# EAGLE design dustmap (EAGLE 9.4.1)
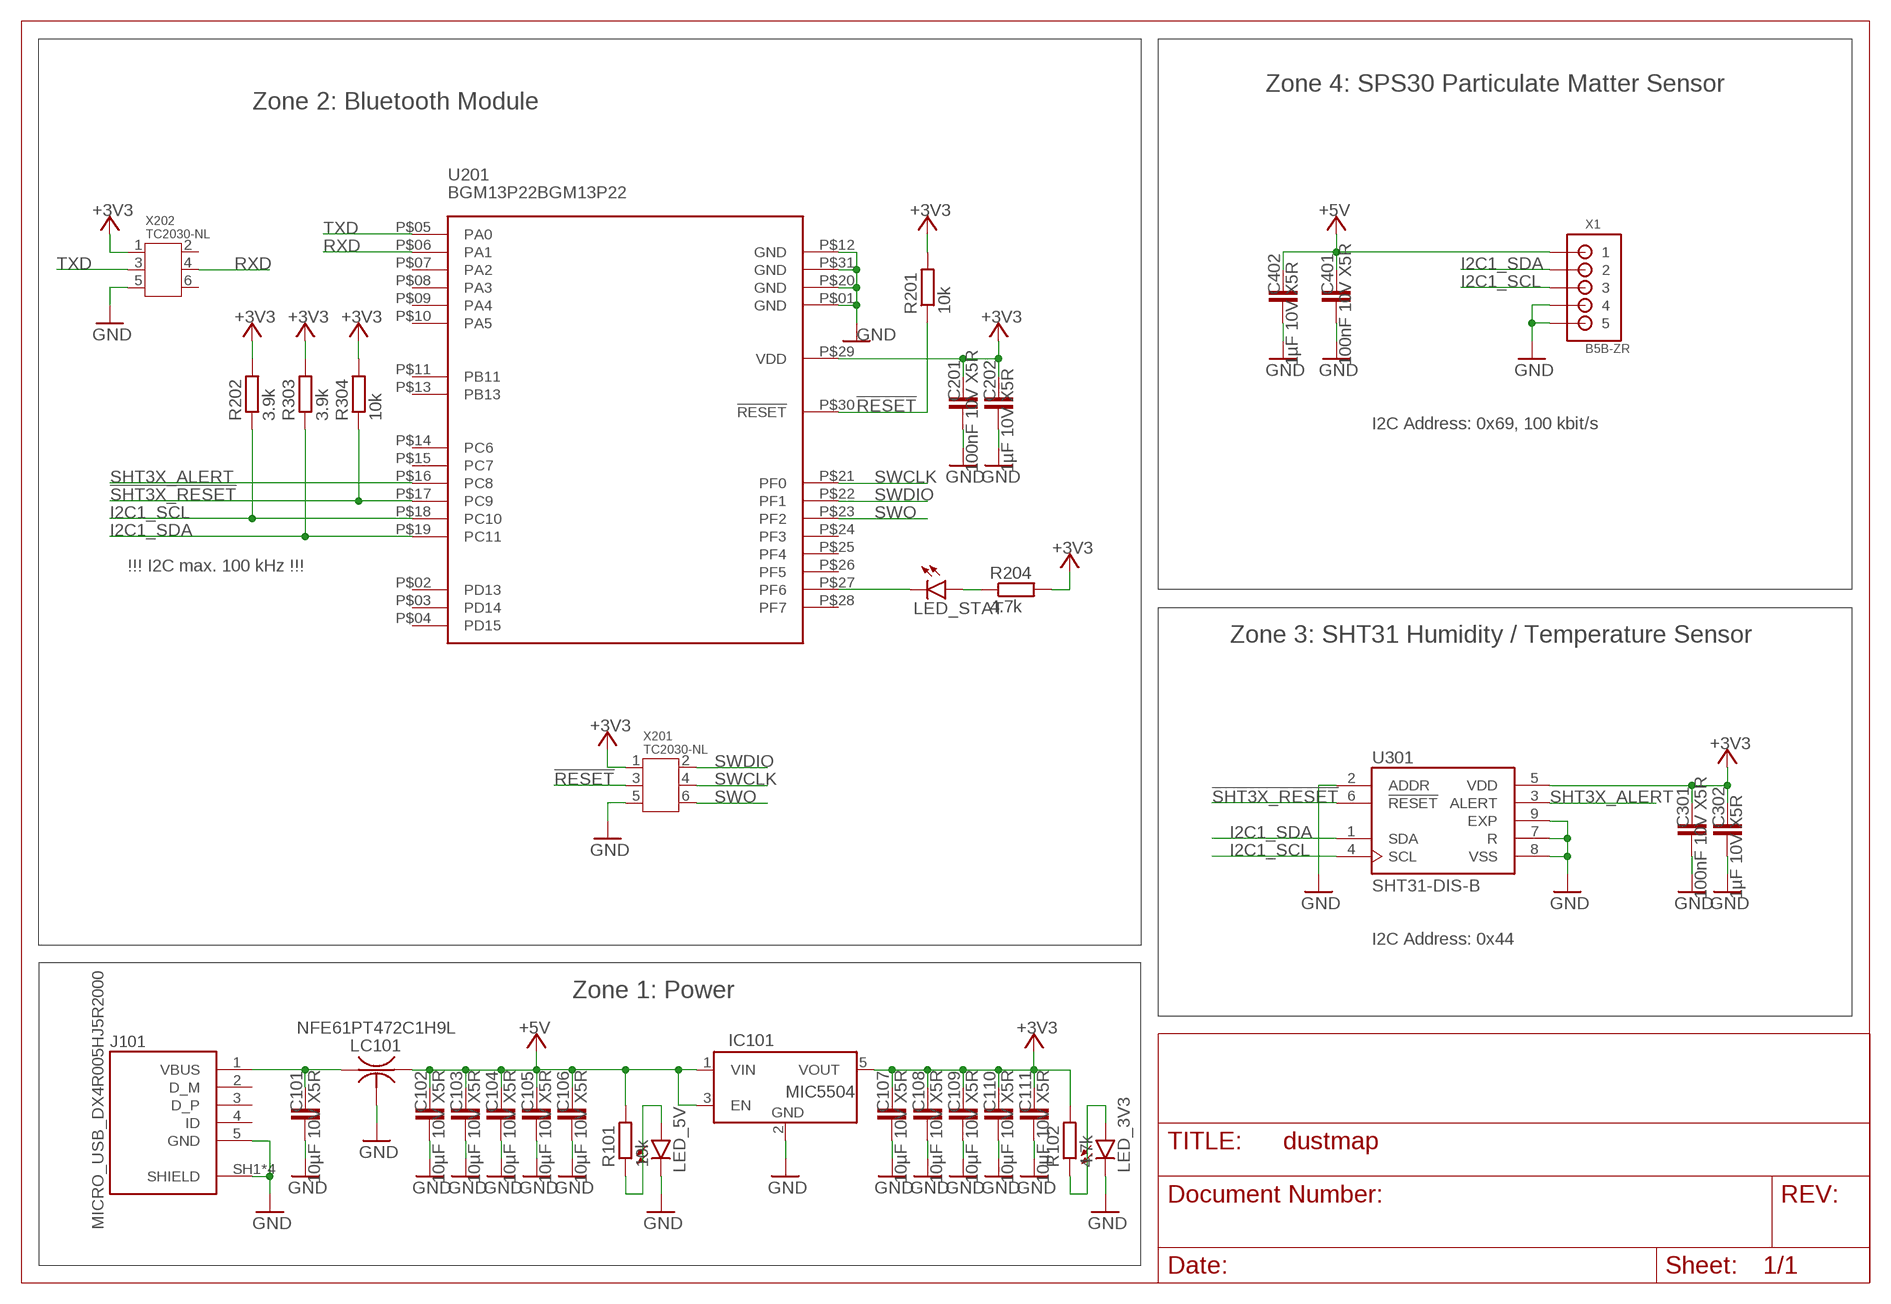
[diagram p0: schematic, sheet 1]

## Parts
C101  10µF 10V X5R  C-EUC0603  [C0603]
C102  10µF 10V X5R  C-EUC0603  [C0603]
C103  10µF 10V X5R  C-EUC0603  [C0603]
C104  10µF 10V X5R  C-EUC0603  [C0603]
C105  10µF 10V X5R  C-EUC0603  [C0603]
C106  10µF 10V X5R  C-EUC0603  [C0603]
C107  10µF 10V X5R  C-EUC0603  [C0603]
C108  10µF 10V X5R  C-EUC0603  [C0603]
C109  10µF 10V X5R  C-EUC0603  [C0603]
C110  10µF 10V X5R  C-EUC0603  [C0603]
C111  10µF 10V X5R  C-EUC0603  [C0603]
C201  100nF 10V X5R  C-EUC0603  [C0603]
C202  1µF 10V X5R  C-EUC0603  [C0603]
C301  100nF 10V X5R  C-EUC0603  [C0603]
C302  1µF 10V X5R  C-EUC0603  [C0603]
C401  100nF 10V X5R  C-EUC0603  [C0603]
C402  1µF 10V X5R  C-EUC0603  [C0603]
IC101  MIC5504  [SOT23-5]
J101  MICRO_USB_DX4R005HJ5R2000  [JAE_DX4R005HJ5R2000]
LC101  NFE61PT472C1H9L  [CAP_NFE61P_6P8X1P6]
LED_3V3  LEDCHIP-LED0603  [CHIP-LED0603]
LED_5V  LEDCHIP-LED0603  [CHIP-LED0603]
LED_STAT  LEDCHIP-LED0603  [CHIP-LED0603]
R101  10k  R-EU_R0603  [R0603]
R102  4.7k  R-EU_R0603  [R0603]
R201  10k  R-EU_R0603  [R0603]
R202  3.9k  R-EU_R0603  [R0603]
R204  4.7k  R-EU_R0603  [R0603]
R303  3.9k  R-EU_R0603  [R0603]
R304  10k  R-EU_R0603  [R0603]
U201  BGM13P22BGM13P22  [BGM13P22]
U301  SHT31-DIS-B  [SON50P250X250X100-9N]
X1  B5B-ZR  [B5B-ZR]
X201  TC2030-NL  [TC2030-NL]
X202  TC2030-NL  [TC2030-NL]

## Nets
!RESET: R201.1 U201.P$30(!RESET) X201.3
!SHT3X_RESET: R304.1 U201.P$17(PC9) U301.6(!RESET)
+3V3: C107.1 C108.1 C109.1 C110.1 C111.1 C201.1 C202.1 C301.1 C302.1 IC101.5(VOUT) R102.2 R201.2 R202.2 R204.2 R303.2 R304.2 U201.P$29(VDD) U301.5(VDD) X201.1 X202.1
+5V: C102.1 C103.1 C104.1 C105.1 C106.1 C401.1 C402.1 IC101.1(VIN) IC101.3(EN) LC101.3 R101.2 X1.1
GND: C101.2 C102.2 C103.2 C104.2 C105.2 C106.2 C107.2 C108.2 C109.2 C110.2 C111.2 C201.2 C202.2 C301.2 C302.2 C401.2 C402.2 IC101.2(GND) J101.5(GND) J101.SH1(SHIELD) J101.SH2(SHIELD) J101.SH3(SHIELD) J101.SH4(SHIELD) LC101.2 LED_3V3.C LED_5V.C U201.P$01(GND) U201.P$12(GND) U201.P$20(GND) U201.P$31(GND) U301.2(ADDR) U301.7(R) U301.8(VSS) U301.9(EXP) X1.4 X1.5 X201.5 X202.5
I2C1_SCL: R202.1 U201.P$18(PC10) U301.4(SCL) X1.3
I2C1_SDA: R303.1 U201.P$19(PC11) U301.1(SDA) X1.2
N$1: LED_5V.A R101.1
N$2: C101.1 J101.1(VBUS) LC101.1
N$3: LED_STAT.C U201.P$27(PF6)
N$4: LED_STAT.A R204.1
N$5: LED_3V3.A R102.1
RXD: U201.P$06(PA1) X202.4
SHT3X_ALERT: U201.P$16(PC8) U301.3(ALERT)
SWCLK: U201.P$21(PF0) X201.4
SWDIO: U201.P$22(PF1) X201.2
SWO: U201.P$23(PF2) X201.6
TXD: U201.P$05(PA0) X202.3
Unconnected: J101.2(D_M) J101.3(D_P) J101.4(ID) U201.P$02(PD13) U201.P$03(PD14) U201.P$04(PD15) U201.P$07(PA2) U201.P$08(PA3) U201.P$09(PA4) U201.P$10(PA5) U201.P$11(PB11) U201.P$13(PB13) U201.P$14(PC6) U201.P$15(PC7) U201.P$24(PF3) U201.P$25(PF4) U201.P$26(PF5) U201.P$28(PF7) X202.2 X202.6

## Notes on the sheet
- Zone 4: SPS30 Particulate Matter Sensor
- Zone 2: Bluetooth Module
- I2C Address: 0x69, 100 kbit/s
- !!! I2C max. 100 kHz !!!
- Zone 3: SHT31 Humidity / Temperature Sensor
- I2C Address: 0x44
- Zone 1: Power

## Library data of the parts
C101-C111 C201 C202 C301 C302 C401 C402 = rcl:C-EU: CAPACITOR, European symbol; SPICEPREFIX: C
IC101 = q:MIC5504
J101 = q:MICRO_USB_DX4R005HJ5R2000: RCPT MICRO USB 2.0 B SMT H/D; DESCRIPTION: DX4 series, receptacle, on-board, right-angle standard mount, surface mount; DIGI-KEY_PART_NUMBER: 670-2674-1-ND; DIGI-KEY_PURCHASE_URL: https://www.digikey.at/product-detail/en/jae-electronics/DX4R005HJ5R2000/670-2674-1-ND/3903234?utm_source=snapeda&utm_medium=aggregator&utm_campaign=symbol; MF: JAE Electronics; MP: DX4R005HJ5R2000; PACKAGE: None
LC101 = q:NFE61PT472C1H9L
LED_3V3 LED_5V LED_STAT = led:LED: LED OSRAM: - CHIPLED LG R971, LG N971, LY N971, LG Q971, LY Q971, LO R971, LY R971 LH N974, LH R974 LS Q976, LO Q976, LY Q976 LO Q996 - Hyper CHIPLED LW Q18S LB Q993, LB Q99A, LB R99A - SideLED LS A670, LO A670, LY A670, LG A670, LP A670 LB A673, LV A673, LT A673, LW A673 LH A674 LY A675 LS A676, LA A676, LO A676, LY A676, LW A676 LS A679, LY A679, LG A679 - Hyper Micro SIDELED® LS Y876, LA Y876, LO Y876, LY Y876 LT Y87S - SmartLED LW L88C, LW L88S LB L89C, LB L89S, LG L890 LS L89K, LO L89K, LY L89K LS L896, LA L896, LO L896, LY L896 - TOPLED LS T670, LO T670, LY T670, LG T670, LP T670 LSG T670, LSP T670, LSY T670, LOP T670, LYG T670 LG T671, LOG T671, LSG T671 LB T673, LV T673, LT T673, LW T673 LH T674 LS T676, LA T676, LO T676, LY T676, LB T676, LH T676, LSB T676, LW T676 LB T67C, LV T67C, LT T67C, LS T67K, LO T67K, LY T67K, LW E67C LS E67B, LA E67B, LO E67B, LY E67B, LB E67C, LV E67C, LT E67C LW T67C LS T679, LY T679, LG T679 LS T770, LO T770, LY T770, LG T770, LP T770 LB T773, LV T773, LT T773, LW T773 LH T774 LS E675, LA E675, LY E675, LS T675 LS T776, LA T776, LO T776, LY T776, LB T776 LHGB T686 LT T68C, LB T68C - Hyper Mini TOPLED® LB M676 - Mini TOPLED Santana® LG M470 LS M47K, LO M47K, LY M47K Source: http://www.osram.convergy.de LUXEON: - LUMILED® LXK2-PW12-R00, LXK2-PW12-S00, LXK2-PW14-U00, LXK2-PW14-V00 LXK2-PM12-R00, LXK2-PM12-S00, LXK2-PM14-U00 LXK2-PE12-Q00, LXK2-PE12-R00, LXK2-PE12-S00, LXK2-PE14-T00, LXK2-PE14-U00 LXK2-PB12-K00, LXK2-PB12-L00, LXK2-PB12-M00, LXK2-PB14-N00, LXK2-PB14-P00, LXK2-PB14-Q00 LXK2-PR12-L00, LXK2-PR12-M00, LXK2-PR14-Q00, LXK2-PR14-R00 LXK2-PD12-Q00, LXK2-PD12-R00, LXK2-PD12-S00 LXK2-PH12-R00, LXK2-PH12-S00 LXK2-PL12-P00, LXK2-PL12-Q00, LXK2-PL12-R00 Source: www.luxeon.com KINGBRIGHT: KA-3528ASYC Source: www.kingbright.com
R101 R102 R201 R202 R204 R303 R304 = rcl:R-EU_: RESISTOR, European symbol; SPICEPREFIX: R
U201 = quadratic:BGM13P22: Silicon Labs BGM13P22 BLE-Module Bluetooth 5 Radio 2.4 GHz GFSK Up to +8 Programmable Output Power 9.9 mA RX Current 9.5 mA Active-mode TX at 0 dBm MCU and Memory Options 40 MHz ARM Cortex®-M4 Low Active Mode Current: 87 µA/MHz 512 kB Flash 64 kB RAM BGM13P22 auf der silicon labs <https://www.silabs.com/products/wireless/bluetooth/bluetooth-low-energy-modules/bgm13p-bluetooth-module>
U301 = q:SHT31-DIS-B: SHT31 Series 5.5 V 800 µA Surface Mount Humidity and Temperature Sensor; AVAILABILITY: Unavailable; DESCRIPTION: SHT31 Series 5.5 V 800 µA Surface Mount Humidity and Temperature Sensor; MF: Sensirion AG; MP: SHT31-DIS-B; PACKAGE: TDFN-8 Sensirion; PRICE: None
X1 = q:B5B-ZR: JST-ZH Connector 5 pol, 1.5mm pitch Package: B5B-ZR Source: http://www.jst-mfg.com/product/pdf/eng/eZH.pdf
X201 X202 = X:TC2030: Tag-Connect In Circuit Programming & Debug Cable with IDC connector, 6 Pin Sources: http://www.tag-connect.com/TC2030-IDC http://www.tag-connect.com/TC2030-MCP http://www.tag-connect.com/TC2030-IDC-NL http://www.tag-connect.com/TC2030-MCP-NL

## Board
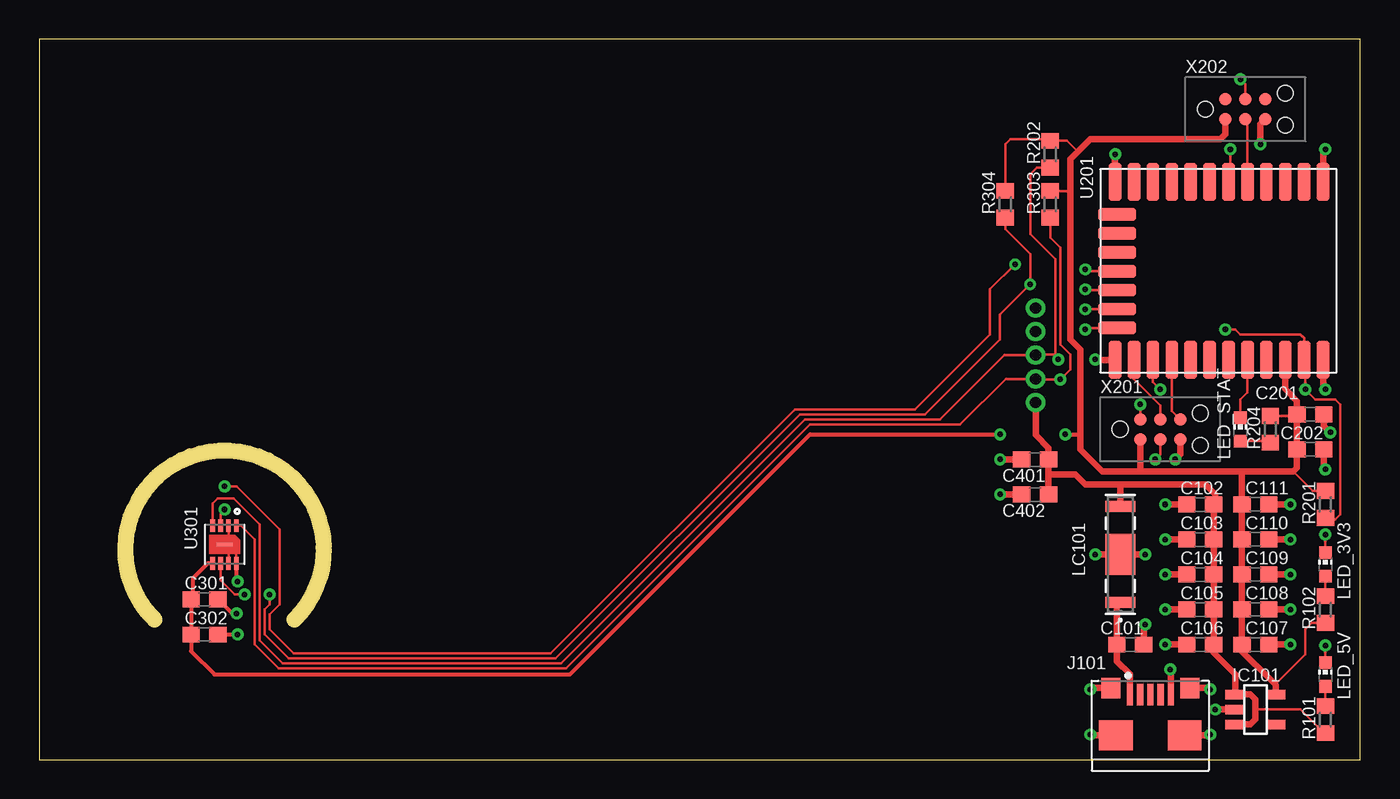
[diagram p1: board, top side]
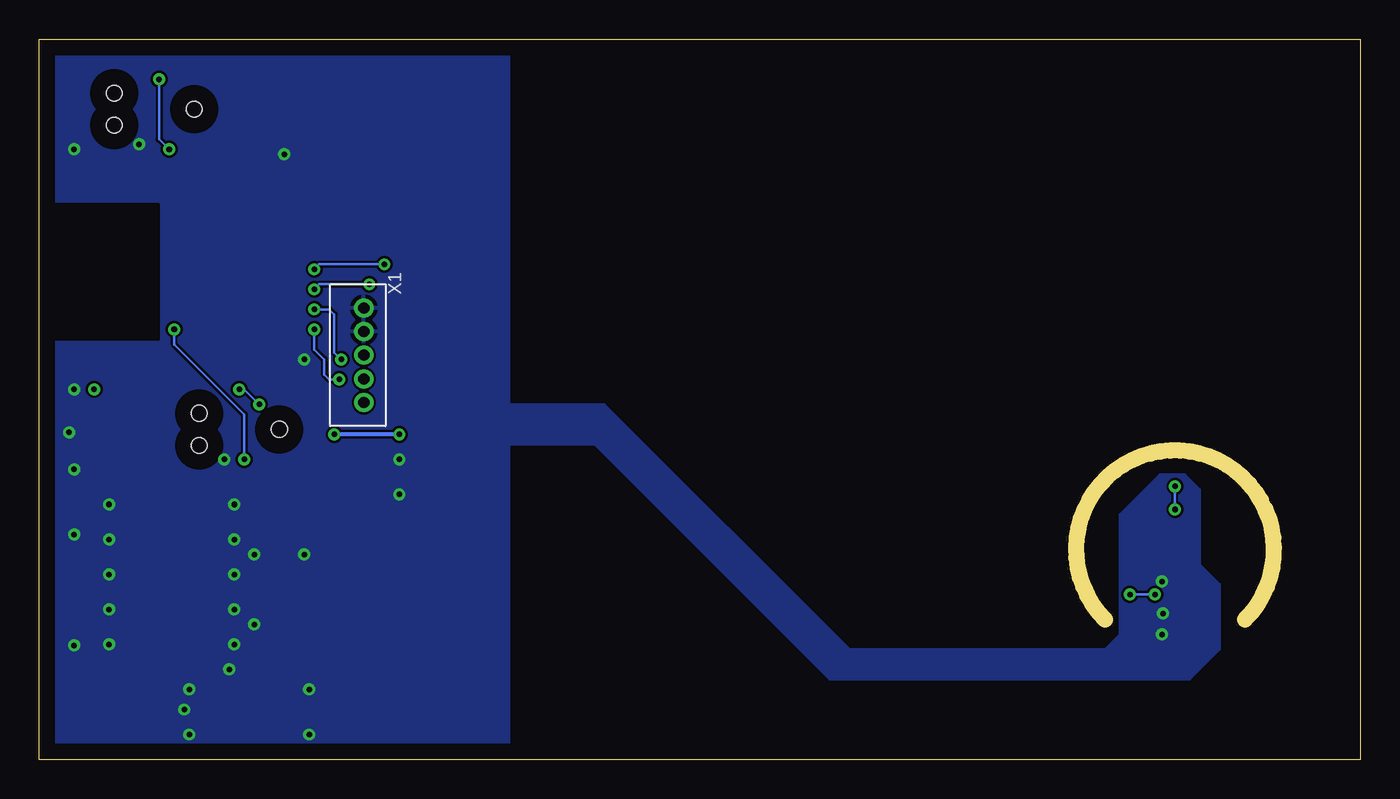
[diagram p2: board, bottom side, seen from below]

Size 83.8 x 45.71 mm. Coordinates in mm from the lower left corner, seen from the top.
Outline: 0,0 83.8,0 83.8,45.71 0,45.71 0,0
Copper layers (1*16): Top 0.035mm / dielectric 1.5mm / Bottom 0.035mm
Design rules "default": minimum track width 6mil, minimum drill 0.35mm, track to track 6mil, track to pad 6mil, pad to pad 6mil, via to via 6mil, smd to smd 6mil, copper to edge 40mil, drill to drill 6mil, minimum pad ring 10mil, minimum via ring 8mil, stop-mask expansion 4mil, vias tented up to drill 0mil, thermal gap 10mil
tKeepout: area 18.7,2.2 to 59.7,43.2
Milling: 1 lines

### Footprints (pad centres in the part's own frame; a part is rotated, then mirrored left to right if it is on the bottom)
C0603 = smd 1.1 x 1: 1 -0.85,0; 2 0.85,0
SOT23-5 = smd 0.6 x 1.2: 1 -0.95,-1.306; 2 0,-1.306; 3 0.95,-1.306; 4 0.95,1.306; 5 -0.95,1.306
JAE_DX4R005HJ5R2000 = smd 0.4 x 1.35: 1 -1.3,0; 2 -0.65,0; 3 0,0; 4 0.65,0; 5 1.3,0 | smd 1.2 x 1.3: SH1 -2.5,0.425; SH2 2.5,0.425 | smd 2.15 x 1.9: SH3 -2.175,-2.575; SH4 2.175,-2.575
CAP_NFE61P_6P8X1P6 = smd 0.7 x 1.9: 1 -3.05,0; 3 3.05,0 | smd 2.6 x 1.9: 2 0,0
CHIP-LED0603 = smd 0.8 x 0.8: A 0,-0.75; C 0,0.75
R0603 = smd 1 x 1.1: 1 -0.85,0; 2 0.85,0
BGM13P22 = smd 2.4 x 0.8: P$01 0.8,14.14; P$02 0.8,12.94; P$03 0.8,11.74; P$04 0.8,10.54; P$05 0.8,9.34; P$06 0.8,8.14; P$07 0.8,6.94; P$08 0.8,5.74; P$09 0.8,4.54; P$10 0.8,3.34; P$11 0.8,2.14; P$12 0.8,0.94; P$20 12.1,0.94; P$21 12.1,2.14; P$22 12.1,3.34; P$23 12.1,4.54; P$24 12.1,5.74; P$25 12.1,6.94; P$26 12.1,8.14; P$27 12.1,9.34; P$28 12.1,10.54; P$29 12.1,11.74; P$30 12.1,12.94; P$31 12.1,14.14 | smd 0.8 x 2.4: P$13 2.87,1.08; P$14 4.07,1.08; P$15 5.27,1.08; P$16 6.47,1.08; P$17 7.67,1.08; P$18 8.87,1.08; P$19 10.07,1.08
SON50P250X250X100-9N = smd 0.8 x 0.3: 1 -1.2,0.75; 2 -1.2,0.25; 3 -1.2,-0.25; 4 -1.2,-0.75; 5 1.2,-0.75; 6 1.2,-0.25; 7 1.2,0.25; 8 1.2,0.75 | smd 0.2 x 1: 9 0,0
B5B-ZR = drill 0.7: 1 7.5,-1.3; 2 6,-1.3; 3 4.5,-1.3; 4 3,-1.3; 5 1.5,-1.3
TC2030-NL = smd 0.787 x 0.787: 1 -1.27,-0.635; 2 -1.27,0.635; 3 0,-0.635; 4 0,0.635; 5 1.27,-0.635; 6 1.27,0.635 | hole 1: -2.54,0; 2.54,1.016; 2.54,-1.016

### Placement (x,y rotation side)
C101  69.22,7.3 0 top
C102  73.66,16.19 180 top
C103  73.66,13.97 180 top
C104  73.66,11.75 180 top
C105  73.66,9.53 180 top
C106  73.66,7.3 180 top
C107  77.15,7.3 0 top
C108  77.15,9.53 0 top
C109  77.15,11.75 0 top
C110  77.15,13.97 0 top
C111  77.15,16.19 0 top
C201  80.64,21.91 0 top
C202  80.64,19.68 0 top
C301  10.48,10.16 0 top
C302  10.48,7.94 0 top
C401  63.18,19.05 180 top
C402  63.18,16.83 180 top
IC101  77.15,3.17 270 top
J101  70.48,4.13 0 top
LC101  68.58,13.02 90 top
LED_3V3  81.6,12.38 0 top
LED_5V  81.6,5.4 0 top
LED_STAT  76.2,20.95 0 top
R101  81.6,2.54 270 top
R102  81.6,9.53 270 top
R201  81.6,16.19 90 top
R202  64.14,38.42 90 top
R204  78.11,20.95 90 top
R303  64.14,35.24 90 top
R304  61.28,35.24 90 top
U201  67.31,37.47 270 top
U301  11.75,13.65 270 top
X1  61.91,30.16 270 bottom
X201  71.12,20.95 0 top
X202  76.52,41.27 0 top

### Tracks (layer width: path | path; a pad name or v marks a point on that pad's centre or on a via)
!RESET  (via drill 0.35)
  Top 0.152: X201.3 71.12,19.37 v70.8,19.05 | R201.1 81.7,15.24 82.23,15.24 82.55,15.56 82.55,22.54 82.23,22.86 80.96,22.86 v80.33,23.5 80.33,25.29 U201.P$30 80.25,26.75 80.01,26.99 76.2,26.99 75.88,27.3 v75.25,27.3
  Bottom 0.152: v70.8,19.05 70.8,21.91 75.25,26.35 v75.25,27.3
!SHT3X_RESET  (via drill 0.35)
  Top 0.152: U301.6 11.5,11.36 12.38,10.48 v13.02,10.48 | v14.61,10.48 14.61,9.84 14.29,9.53 14.29,7.94 15.81,6.41 32.77,6.41 48.26,21.91 56.2,21.91 60.96,26.67 60.96,28.26 v62.87,30.16 62.87,32.07 61.28,33.66 R304.1 | U201.P$17 66.41,29.8 v66.36,29.84
  Bottom 0.152: v13.02,10.48 v14.61,10.48 | v66.36,29.84 66.04,30.16 v62.87,30.16
+3V3  (via drill 0.35)
  Top 0.152: R204.2 79.69,21.8 C201.1 | R201.2 80.81,17.04 79.57,18.29 | R303.2 65.19,36.09 65.41,35.88 | 65.88,38.58 65.19,39.27 R202.2 64.03,39.37 61.59,39.37 61.28,39.05 R304.2 | R102.2 80.75,8.68 80.33,8.26 80.33,6.67 78.42,4.76
  Top 0.254: U301.5 10.68,12.45 9.73,11.5 9.73,10.16 C301.1 C302.1 9.63,6.88 11.11,5.4 33.66,5.4 48.9,20.64 v60.96,20.64 | v65.09,20.64 66.04,20.64
  Top 0.406: IC101.5 78.46,4.73 78.42,4.76 78.07,5.11 76.3,6.88 C107.1 C108.1 C109.1 C110.1 C111.1 76.3,18.29 | X201.1 69.85,18.29 | 69.85,18.29 69.34,18.29 67.44,18.29 66.04,19.68 66.04,20.64 66.04,26.04 65.41,26.67 65.41,35.88 65.41,38.1 65.88,38.58 66.67,39.37 74.93,39.37 75.25,39.69 X202.1 | 69.85,18.29 76.3,18.29 | U201.P$29 79.05,23.5 79.8,22.76 C201.1 C202.1 79.8,18.52 79.57,18.29 76.3,18.29
  Bottom 0.254: v60.96,20.64 v65.09,20.64
+5V
  Top 0.152: R101.2 81.5,1.69 80.01,3.17 77.15,3.17
  Top 0.406: LC101.3 68.58,17.46 | 68.58,17.46 73.98,17.46 74.61,16.83 74.61,16.3 C102.1 C103.1 C104.1 C105.1 C106.1 74.51,6.77 75.88,5.4 75.88,4.16 IC101.1 76.84,4.12 77.15,3.81 77.15,3.17 77.15,2.54 76.83,2.22 IC101.3 | 68.58,17.46 66.36,17.46 65.72,18.1 64.03,18.1 | X1.1 63.21,20.61 64.03,19.79 C401.1 64.03,18.1 | 64.03,18.1 C402.1
GND  (via drill 0.35)
  Top 0.152: LED_5V.C v81.6,7.24 | LED_3V3.C v81.6,14.29 | U301.2 12,13.9 U301.9 | U301.9 12.06,13.34 12.38,13.34 12.5,13.22 U301.8 | U301.7 12,13.4 U301.9
  Top 0.254: C302.2 v12.57,7.94 | v12.51,9.27 12.22,9.27 C301.2 | U301.8 12.5,11.38 v12.57,11.3
  Top 0.406: J101.SH1 66.78,4.55 v66.67,4.45 | J101.SH3 66.71,1.55 v66.67,1.59 | J101.SH2 74.19,4.55 v74.3,4.45 | J101.SH4 74.26,1.55 v74.3,1.59 | J101.5 71.78,5.68 v71.75,5.71 | IC101.2 v74.61,3.17 | C102.2 v71.44,16.19 | C103.2 v71.44,13.97 | C104.2 v71.44,11.75 | C105.2 v71.44,9.53 | C106.2 v71.44,7.3 | C101.2 70.06,8.47 v70.17,8.57 | C111.2 v79.38,16.19 | C110.2 v79.38,13.97 | C109.2 v79.38,11.75 | C108.2 v79.38,9.53 | C107.2 v79.38,7.3 | U201.P$31 81.45,23.64 v81.6,23.5 | C201.2 81.5,21.18 v81.92,20.77 | C202.2 81.5,18.52 v81.6,18.41 | U201.P$01 81.45,38.59 v81.6,38.73 | U201.P$12 68.25,38.41 v68.26,38.42 | U201.P$20 67.03,25.36 v66.99,25.4 | X201.5 72.39,19.37 v72.07,19.05 | X202.5 77.47,40.32 v77.47,39.05 | v70.17,13.02 LC101.2 v66.99,13.02 | C401.2 v60.96,19.05 | C402.2 v60.96,16.83
  pour Bottom (isolate 0.127): 53.98,45.72 83.82,45.72 83.82,0 53.98,0
  cutout Bottom (isolate 0.127): 76.2,35.24 83.82,35.24 83.82,26.67 76.2,26.67
  pour Bottom (isolate 0.127): 8.89,6.99 8.89,11.11 10.16,12.38 10.16,17.14 11.11,18.1 12.7,18.1 15.24,15.56 15.24,7.94 16.19,6.99 32.38,6.99 47.94,22.54 56.2,22.54 56.2,20 48.58,20 33.66,5.08 10.79,5.08
I2C1_SCL  (via drill 0.35)
  Top 0.152: U301.4 11,16.27 11.3,16.57 12.32,16.57 13.97,14.92 13.97,7.56 15.43,6.1 33.08,6.1 48.58,21.59 57.15,21.59 61.22,25.66 X1.3 63.27,25.72 64.45,25.72 | U201.P$18 66.38,28.59 v66.36,28.57 | R202.1 63.28,37.57 62.87,37.15 62.87,33.34 64.45,31.75 64.45,25.72 | v64.64,25.4 64.45,25.59 64.45,25.72
  Bottom 0.152: v64.64,25.4 65.09,25.84 65.09,28.26 65.41,28.57 v66.36,28.57
I2C1_SDA  (via drill 0.35)
  Top 0.152: U301.1 12.77,14.85 13.65,13.97 13.65,7.3 15.18,5.78 33.4,5.78 48.9,21.27 58.42,21.27 61.31,24.16 X1.2 63.24,24.13 v64.77,24.13 65.41,24.77 65.41,25.72 64.77,26.35 64.77,32.49 64.14,33.12 R303.1 | U201.P$19 66.45,27.39 v66.36,27.3
  Bottom 0.152: v66.36,27.3 66.36,26.04 65.72,25.4 65.72,24.45 65.41,24.13 v64.77,24.13
N$1
  Top 0.152: R101.1 LED_5V.A
N$2
  Top 0.406: J101.1 69.19,5.43 68.36,6.25 C101.1 68.36,9.75 LC101.1
N$3
  Top 0.152: U201.P$27 76.65,23.31 76.2,22.86 LED_STAT.C
N$4
  Top 0.152: LED_STAT.A 78,20.2 R204.1
N$5
  Top 0.152: R102.1 LED_3V3.A
RXD  (via drill 0.35)
  Top 0.152: X202.4 76.52,42.86 v76.2,43.18 | v75.56,38.73 75.56,36.78 U201.P$06
  Bottom 0.152: v76.2,43.18 76.2,39.37 v75.56,38.73
SHT3X_ALERT  (via drill 0.35)
  Top 0.152: U301.3 11.5,15.62 v11.75,15.88 | v11.75,17.34 12.51,17.34 15.24,14.61 15.24,9.84 14.61,9.21 14.61,8.26 16.13,6.73 32.45,6.73 47.94,22.23 55.56,22.23 60.33,26.99 60.33,29.84 v61.91,31.43 | U201.P$16 66.48,31 v66.36,31.11
  Bottom 0.152: v11.75,15.88 v11.75,17.34 | v66.36,31.11 66.04,31.43 v61.91,31.43
SWCLK
  Top 0.152: X201.4 71.12,22.48 69.45,24.15 U201.P$21
SWDIO  (via drill 0.35)
  Top 0.152: X201.2 v69.85,22.54 | v71.12,23.5 70.65,23.96 U201.P$22
  Bottom 0.152: v69.85,22.54 70.8,23.5 v71.12,23.5
SWO
  Top 0.152: X201.6 71.85,22.13 U201.P$23
TXD
  Top 0.152: U201.P$05 76.65,40.51 X202.3

### Text on the board
tDocu: Air out | SPS30 | Air in